# Altium schematic sheet SDEC944-xD_Machines_laver_2-2_(commande).SchDoc: Machines à laver 2/2 (commande)
size 393 x 270 mm; CompanyName: Seccom; Address1: 521, rue du capt. François Garbit; Address2: 69440 Mornant; Address3: seccom@seccom.fr; Address4: www.seccom.fr; DocumentNumber: 17; SheetNumber: 17; SheetTotal: 22; PageSetup: Record=PageOptions|CenterHorizontal=True|CenterVertical=True|PrintScale=0.74|XCorrection=1.00|YCorrection=1.00|PrintKind=0|BorderSize=5000000|LeftOffset=0|BottomOffset=0|Orientation=2|PaperLength=1000|PaperWidth=1000|Scale=100|PaperSource=7|PrintQuality=-4|MediaType=1|DitherType=10|PaperKind=A4|PrintScaleMode=1
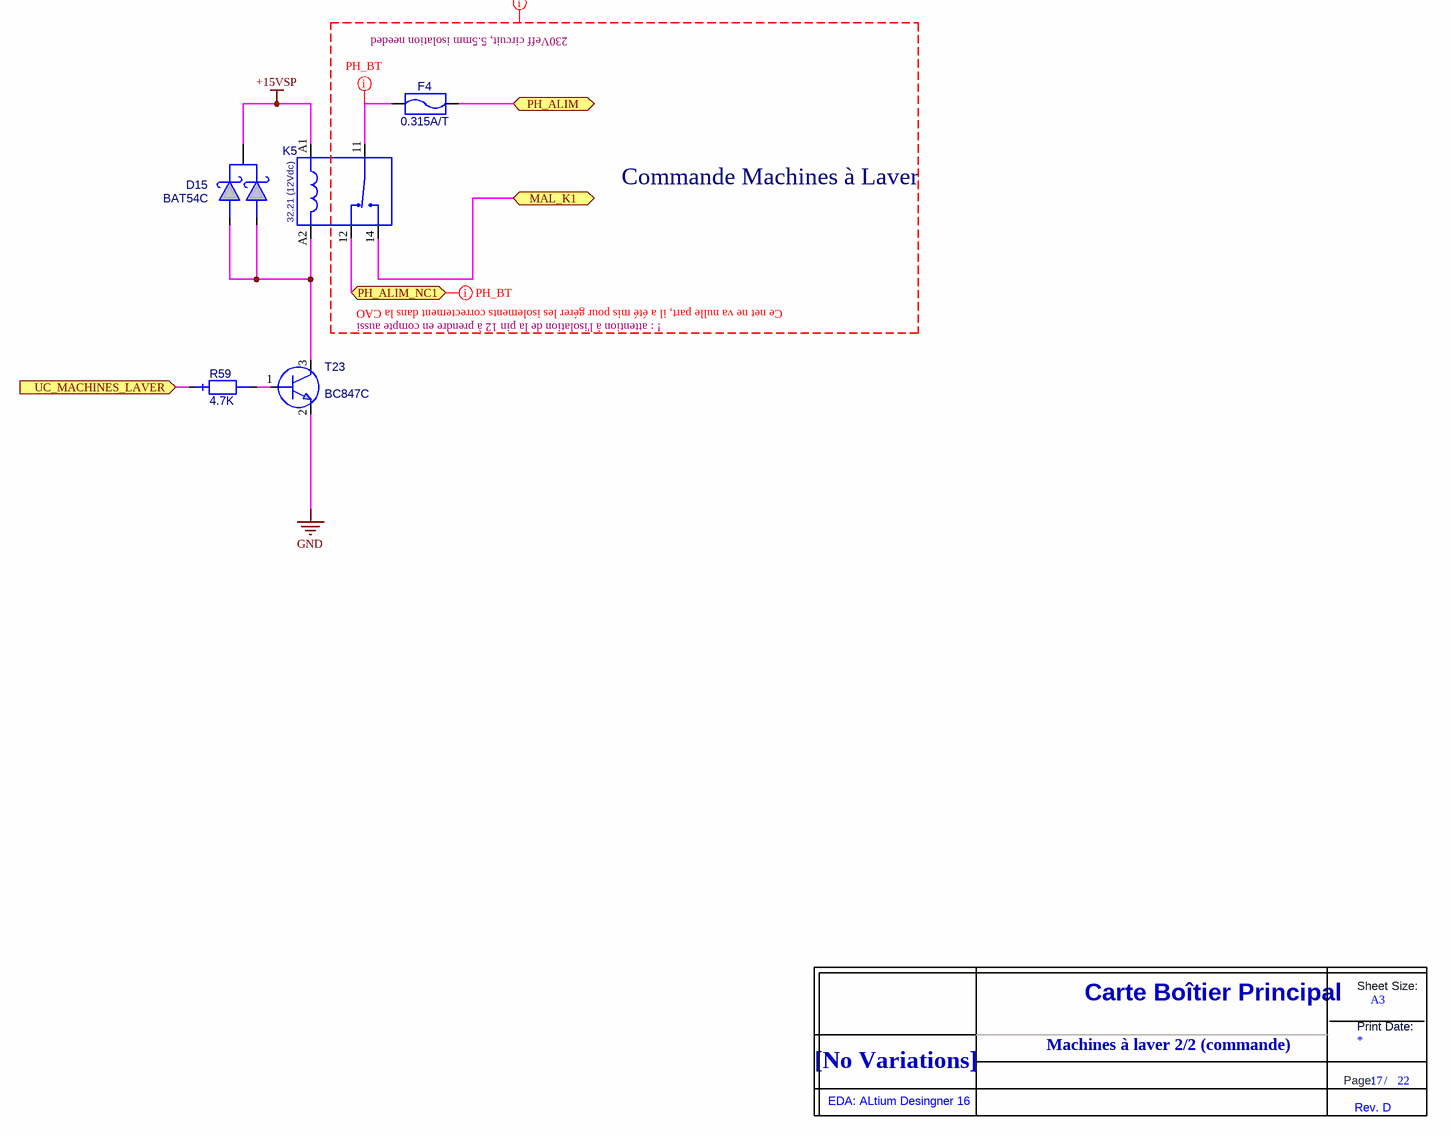
[diagram p0: SDEC944-xD_Machines_laver_2-2_(commande).SchDoc]

## Parts
D15  BAT54C  [SOT23_3L_ReflowSoldering]
F4  value 0.315A/T  [FUSIBLE_UMT250]  (hidden comment: FUSIBLE_UMT250_0.315A_T)
K5  value 32.21 (12Vdc)  [RELAY_FINDER_32.21]  (hidden comment: RELAY_12VDC_1RT_32.21)
R59  value 4.7K  [0603_ReflowSoldering_RES]  (hidden comment: RES_0603_1%_100PPM_4.7K)
T23  BC847C  [SOT23_3L_ReflowSoldering]
Title_new  DNI  (value not drawn)  (graphical)

## Ports
MAL_K1 (bidir), PH_ALIM (bidir), PH_ALIM_NC1 (bidir), UC_MACHINES_LAVER (in)

## Nets
+15VSP: D15.3 K5.A1
GND: T23.2(E)
MAL_K1: K5.14(NO) ; port MAL_K1
PH_ALIM: F4.2 ; port PH_ALIM
PH_ALIM_NC1: K5.12(NC) ; port PH_ALIM_NC1
UC_MACHINES_LAVER: R59.1 ; port UC_MACHINES_LAVER
NetD15_1: D15.1 D15.2 K5.A2 T23.3(C)
NetF4_1: F4.1 K5.11(COM)
NetR59_2: R59.2 T23.1(B)

## Layout directives
net class BT: (no net found under the mark)
net class PH_BT: NetF4_1, PH_ALIM_NC1

## Notes on the sheet
- 230Veff circuit, 5.5mm isolation needed
- Commande Machines à Laver
- ! : attention à l'isolation de la pin 12 à prendre en compte aussi
- Ce net ne va nulle part, il a été mis pour gérer les isolements correctement dans la CAO
- Machines à laver 2/2 (commande)
- (in symbol Title_new) Sheet Size:; Carte Boîtier Principal; A3; Print Date:; [No Variations]; Page:; /; EDA: ALtium Desingner 16; Rev. D

## Library data of the parts
D15 = BAT54C: Diode Schottky double, BAT54 cathode com, Vrrm=30V, If=300mA, Vf=0.4Vmax, CMS; Creation: LJ (14/05/02); Reference: 000597/00; Boitier: SOT23_3L; Remarque: {Remarque}; Coeff: 1; Fabricant: NXP; Verification: LJ (14/05/02); ComponentLink1URL: O:\_Documentation\Datasheets\NXP\BAT54_series.pdf; ComponentLink2URL: o:\_Documentation\Datasheets\_BOITIERS\ACTIF_CMS\SOT\SOT_23_3P_(Schneider).PDF; Config: *; ComponentLink1Description: Datasheet; ComponentLink2Description: Datasheet Boitier; Ref Fab: BAT54C; Supplier 1: Farnell; Supplier Part Number 1: 1081192; Value: BAT54C
F4 = FUSIBLE_UMT250_0.315A_T: Fusible CMS, série UMT250, à souder sur CI, 250Vca/125Vdc, 0.315A, Temporisé; Creation: PDP (26/09/12); Boitier: UMT250_(10.1x3mm); Remarque: Valeurs: de 80mA à 10A; Coeff: 1; Fabricant: Schurter; Ref Fab: 3403.0161; Config: *; ComponentLink1Description: Datasheet; ComponentLink1URL: O:\_Documentation\Datasheets\Schurter\Fusibles_CMS_UMT_250.pdf; ComponentLink2Description: Datasheet Boitier; ComponentLink2URL: o:\_Documentation\Datasheets\Littelfuse\449.pdf; Supplier 1: Mouser; Supplier Part Number 1: 693-3403.0161.11; Supplier 2: Farnell; Supplier Part Number 2: 1221084
K5 = RELAY_12VDC_1RT_32.21: Relais 1RT, 12Vdc, série 32.21, Rc=720R, Sw:250Vac/6A, Ron=? (AgCdO); Creation: CHD (21/03/12); Boitier: 20x10x10.7mm; Remarque: {Remarque}; Fabricant: Finder; Ref Fab: 32.21.7.012.2000; Coeff: 1; ComponentLink1URL: O:\_Documentation\Datasheets\Finder\Relais_Serie_32.pdf; ComponentLink2URL: o:\_Documentation\Datasheets\Finder\; Config: *; ComponentLink1Description: Datasheet; ComponentLink2Description: Datasheet Boitier; Supplier 1: Farnell; Supplier Part Number 1: 1329652
R59 = RES_0603_1%_100PPM_4.7K: Résistance, 0.100W, 1%, 100ppm, 75V, 4.7K; Creation: JPL (05/07/12); Boitier: 0603; Remarque: {Remarque}; Fabricant: Vishay; Ref Fab: CRCW06034K70FKEA; Coeff: 1; Verification: *; ComponentLink1URL: O:\_Documentation\Datasheets\Vishay\Resistances_D-CRCWe3.pdf; ComponentLink2URL: o:\_Documentation\Datasheets\_BOITIERS\PASSIF_CMS\; Config: *; ComponentLink1Description: Datasheet; ComponentLink2Description: Datasheet Boitier; Supplier 1: Farnell; Supplier 2: RadioSpares; Supplier Part Number 1: 1469807; Supplier Part Number 2: 6790484
T23 = BC847C: Transistor NPN, Vce=50V, Ic=0.1A, hfe=420~800, 0.25W, CMS; Creation: GO (08/07/05); Verification: LJ (21/07/05); Reference: 000329/00; Boitier: SOT23_3L; Remarque: Complementaires aux BC856-860; Fabricant: NXP; Coeff: 1; Ref Fab: BC847C; ComponentLink1URL: O:\_Documentation\Datasheets\NXP\BC847.pdf; ComponentLink2URL: o:\_Documentation\Datasheets\_BOITIERS\ACTIF_CMS\SOT\SOT_23_3P_(Schneider).PDF; Config: *; ComponentLink1Description: Datasheet; Value: BC847C; Supplier 1: Farnell; Supplier Part Number 1: 1081235; ComponentLink2Description: Datasheet Boitier
Title_new = Title_new